# Altium schematic sheet COACH.SchDoc
size A; Organization: Smart Product Design Lab; Address1: 201 Thornton; Address2: Stanford University; Address3: Stanford, CA; Address4: 94305-4021
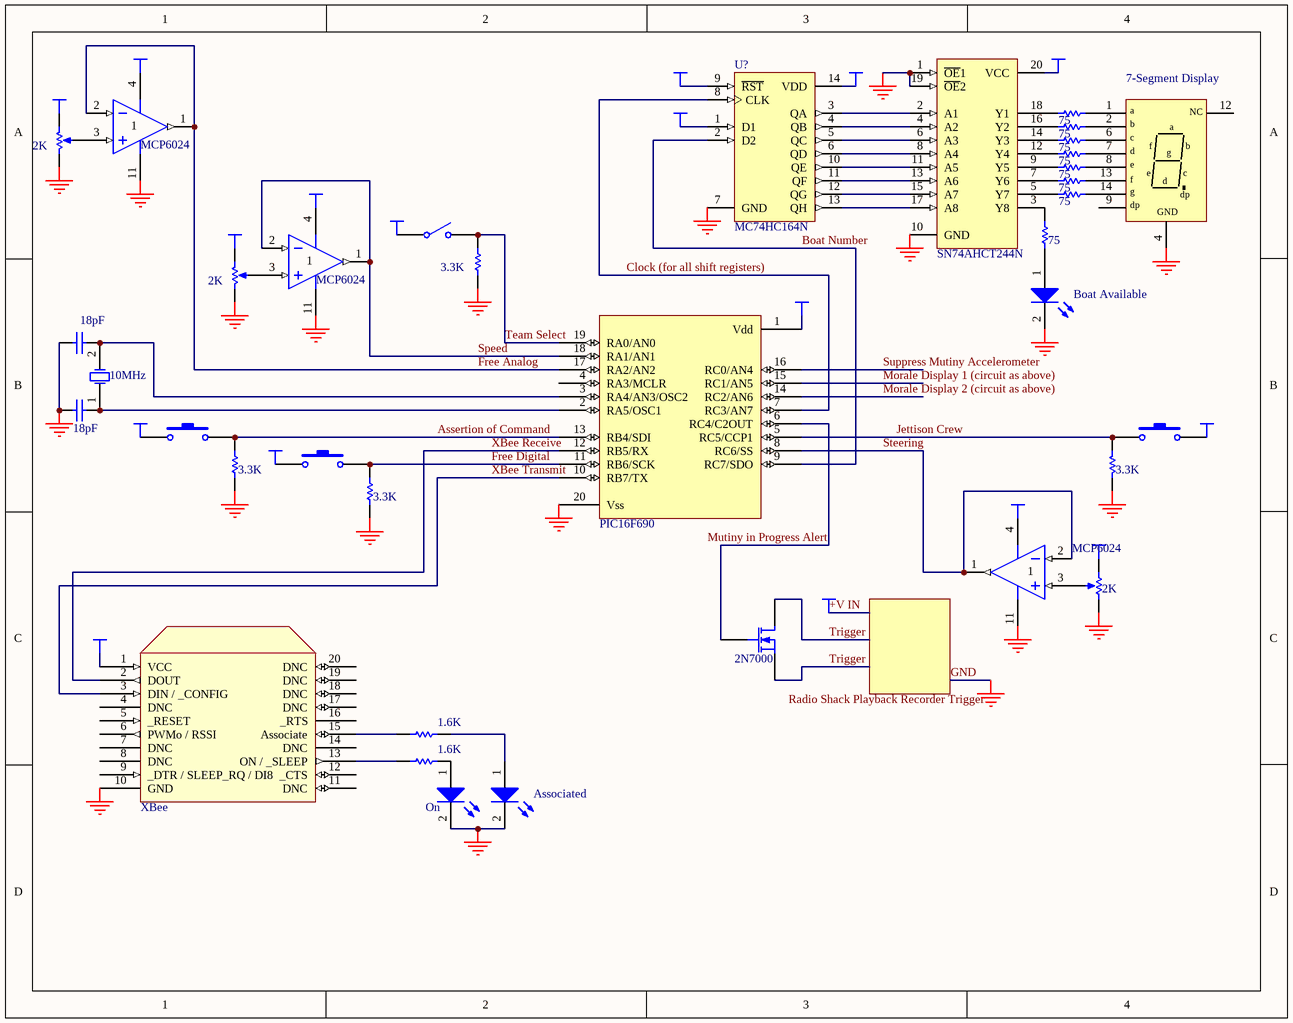
[diagram p0: COACH.SchDoc]

## Parts
(Parts that share a designator on the sheet are numbered #1, #2 ... from top to bottom, then left to right.)
C5  value 18pF  [RAD-0.1]  (hidden comment: Cap)
C6  value 18pF  [RAD-0.1]  (hidden comment: Cap)
D1  On  [LED]
D2#1  Boat Available  [LED]
D2#2  Associated  [LED]
DS?  7-Segment Display  [DIP10]
Q?  2N7000  [BCY-W3/H.8]
R1  value 1.6K  [RAD-0.1]  (hidden comment: Res1)
R2  value 1.6K  [RAD-0.1]  (hidden comment: Res1)
R?#1  value 2K  [VR5]  (hidden comment: RPot1)
R?#2  value 75  [AXIAL-0.3]  (hidden comment: Res1)
R?#3  value 75  [AXIAL-0.3]  (hidden comment: Res1)
R?#4  value 75  [AXIAL-0.3]  (hidden comment: Res1)
R?#5  value 75  [AXIAL-0.3]  (hidden comment: Res1)
R?#6  value 75  [AXIAL-0.3]  (hidden comment: Res1)
R?#7  value 75  [AXIAL-0.3]  (hidden comment: Res1)
R?#8  value 75  [AXIAL-0.3]  (hidden comment: Res1)
R?#9  value 75  [AXIAL-0.3]  (hidden comment: Res1)
R?#10  value 2K  [VR5]  (hidden comment: RPot1)
R?#11  value 3.3K  [AXIAL-0.3]  (hidden comment: Res1)
R?#12  value 3.3K  [AXIAL-0.3]  (hidden comment: Res1)
R?#13  value 3.3K  [AXIAL-0.3]  (hidden comment: Res1)
R?#14  value 3.3K  [AXIAL-0.3]  (hidden comment: Res1)
R?#15  value 2K  [VR5]  (hidden comment: RPot1)
S?#1  SW-SPST  [SPST-2]  (value not drawn)
S?#2  SW-PB  [SPST-2]  (value not drawn)
S?#3  SW-PB  [SPST-2]  (value not drawn)
S?#4  SW-PB  [SPST-2]  (value not drawn)
U1#1  MCP6024  [DIP-14/D19.7]  (part A of 4)
U1#2  MCP6024  [DIP-14/D19.7]  (part A of 4)
U1#3  MCP6024  [DIP-14/D19.7]  (part A of 4)
U2  XBee  [XBee sockets]
U3  (no value)  [DIP-20]
U?#1  SN74AHCT244N  [DIP-20/D25]
U?#2  MC74HC164N  [DIP-14/D19.7]
Y1  10MHz  [BCY-W2/D3.1]

## Nets
+3.3: R?#1.1(TOP) R?#10.1(TOP) R?#15.1(TOP) S?#1.1(COMMON) S?#2.1 S?#3.1 S?#4.1 U1#1.4(V+) U1#2.4(V+) U1#3.4(V+) U2.1(VCC) U3.1(Vdd) U?#2.1(D1) U?#2.9(~{RST}) U?#2.14(VDD)
+5: U?#1.20(VCC)
GND: C5.2 C6.2 D1.2(K) D2#1.2(K) D2#2.2(K) DS?.4(GND) R?#1.2(BOT) R?#10.2(BOT) R?#11.1 R?#12.1 R?#13.1 R?#14.1 R?#15.2(BOT) U1#1.11(GND) U1#2.11(GND) U1#3.11(GND) U2.10(GND) U3.20(Vss) U?#1.1(~{OE}1) U?#1.10(GND) U?#1.19(~{OE}2) U?#2.7(GND)
Assertion of Command: R?#12.2 S?#2.2 U3.13(RB4/SDI)
Boat Number: U3.9(RC7/SDO) U?#2.2(D2)
Clock (for all shift registers): U3.7(RC3/AN7) U?#2.8(CLK)
Free Analog: U1#1.1(OUT) U1#1.2(IN-) U3.17(RA2/AN2)
Free Digital: R?#14.2 S?#4.2 U3.11(RB6/SCK)
Jettison Crew: R?#13.2 S?#3.2 U3.5(RC5/CCP1)
Morale Display 1 (circuit as above): U3.15(RC1/AN5)
Morale Display 2 (circuit as above): U3.14(RC2/AN6)
Speed: U1#2.1(OUT) U1#2.2(IN-) U3.18(RA1/AN1)
Steering: U1#3.1(OUT) U1#3.2(IN-) U3.8(RC6/SS)
Suppress Mutiny Accelerometer: U3.16(RC0/AN4)
Team Select: R?#11.2 S?#1.2(NO) U3.19(RA0/AN0)
Trigger: Q?.1(D) Q?.3(S)
XBee Receive: U2.2(DOUT) U3.12(RB5/RX)
XBee Transmit: U2.3(DIN_/__CONFIG) U3.10(RB7/TX)
NetC5_1: C5.1 U3.3(RA4/AN3/OSC2) Y1.2(OSC2)
NetC6_1: C6.1 U3.2(RA5/OSC1) Y1.1(OSC1)
NetD1_1: D1.1(A) R2.2
NetD2#1_1: D2#1.1(A) R?#9.2
NetD2#2_1: D2#2.1(A) R1.2
NetDS?_1: DS?.1(a) R?#2.1
NetDS?_2: DS?.2(b) R?#3.1
NetDS?_6: DS?.6(c) R?#4.1
NetDS?_7: DS?.7(d) R?#5.1
NetDS?_8: DS?.8(e) R?#6.1
NetDS?_13: DS?.13(f) R?#7.1
NetDS?_14: DS?.14(g) R?#8.1
NetQ?_2: Q?.2(G) U3.6(RC4/C2OUT)
NetR1_1: R1.1 U2.15(Associate)
NetR2_1: R2.1 U2.13(ON_/__SLEEP)
NetR?#1_3: R?#1.3(TAP) U1#1.3(IN+)
NetR?#2_2: R?#2.2 U?#1.18(Y1)
NetR?#3_2: R?#3.2 U?#1.16(Y2)
NetR?#4_2: R?#4.2 U?#1.14(Y3)
NetR?#5_2: R?#5.2 U?#1.12(Y4)
NetR?#6_2: R?#6.2 U?#1.9(Y5)
NetR?#7_2: R?#7.2 U?#1.7(Y6)
NetR?#8_2: R?#8.2 U?#1.5(Y7)
NetR?#9_1: R?#9.1 U?#1.3(Y8)
NetR?#10_3: R?#10.3(TAP) U1#2.3(IN+)
NetR?#15_3: R?#15.3(TAP) U1#3.3(IN+)
NetU?#1_2: U?#1.2(A1) U?#2.3(QA)
NetU?#1_4: U?#1.4(A2) U?#2.4(QB)
NetU?#1_6: U?#1.6(A3) U?#2.5(QC)
NetU?#1_8: U?#1.8(A4) U?#2.6(QD)
NetU?#1_11: U?#1.11(A5) U?#2.10(QE)
NetU?#1_13: U?#1.13(A6) U?#2.11(QF)
NetU?#1_15: U?#1.15(A7) U?#2.12(QG)
NetU?#1_17: U?#1.17(A8) U?#2.13(QH)

Not connected (* = marked no-connect by the designer): DS? 9(RHDP) 12(GND); U2 4(DNC) 5(_RESET) 6(PWMo_/_RSSI) 7(DNC) 8(DNC) 9(_DTR_/_SLEEP_RQ_/_DI8) 11(DNC) 12(_CTS) 14(DNC) 16(_RTS) 17(DNC) 18(DNC) 19(DNC) 20(DNC); U3 4(RA3/MCLR)

## Notes on the sheet
- Labels drawn without touching a wire or pin: Mutiny in Progress Alert, Radio Shack Playback Recorder Trigger
- Title
- Size:
- Date:
- File:
- A
- Number:
- Time:
- Revision:
- Sheet
- of
- Drawn By:
- (in symbol Dpy Red-CC) NC; dp

## Library data of the parts
C5 C6 = Cap: Capacitor; Manufacturer: Generic Components; Class: Passive; Published: 08/06/2000; Publisher: Altium Hobart Technology Centre; SubClass: Capacitor
D1 = LED1: HLMP1700; Manufacturer: Generic Components; Class: Optoelectronic; Published: 08/06/2000; Publisher: Altium Hobart Technology Centre; SubClass: LED
D2#1 D2#2 = LED1: HLMP1790; Manufacturer: Generic Components; Class: Optoelectronic; Published: 08/06/2000; Publisher: Altium Hobart Technology Centre; SubClass: LED
DS? = Dpy Red-CC: Common Cathhode Seven-Segment Display, Right Hand Decimal; Manufacturer: Generic Components; Class: Optoelectronic; SubClass: LED Display; Published: 08/06/2000; Publisher: Altium Hobart Technology Centre
Q? = MOSFET-N: N-Channel MOSFET; Manufacturer: Generic Components; Class: Discrete; SubClass: MOSFET - Low Power; Published: 08/06/2000; Publisher: Altium Hobart Technology Centre
R1 R2 R?#2-R?#9 R?#11-R?#14 = Res1: Resistor; Manufacturer: Generic Components; Class: Passive; Published: 08/06/2000; Publisher: Altium Hobart Technology Centre; SubClass: Resistor
R?#1 R?#10 R?#15 = RPot1: Potentiometer; Manufacturer: Generic Components; Class: Passive; Set Position: 0.5; Published: 08/06/2000; Publisher: Altium Hobart Technology Centre; SubClass: Potentiometer
S?#1 = SW-SPST: Single-Pole, Single-Throw Switch; Manufacturer: Generic Components; Published: 1999
S?#2-S?#4 = SW-PB: Switch; Manufacturer: Generic Components; Published: 1999
U1#1-U1#3 = LM324N: Low-Power Quad Operational Amplifier; Manufacturer: National Semiconductor; Published: 15/04/2002; Publisher: Altium Hobart Technology Centre; Class: Amplifier; SubClass: Operational Amplifier
U2 = XBee: MaxStream Zibee RF radio module
U3 = PIC16F690
U?#1 = SN74AHCT244N: Octal Buffer/Driver with 3-State Outputs; Manufacturer: Texas Instruments; Class: Logic; SubClass: Buffer/Line Driver; Published: 8/06/2000; Publisher: Altium Hobart Technology Centre
U?#2 = MC74HC164N: 8-Bit Serial-Input/Parallel-Output Shift Register; Manufacturer: Motorola; Class: Logic; Published: 15/04/2002; Publisher: Altium Hobart Technology Centre; SubClass: Register
Y1 = XTAL: Crystal Oscillator; Manufacturer: Generic Components; Published: 08/06/2000; Publisher: Altium Hobart Technology Centre; Class: Oscillator; SubClass: Crystal Oscillator